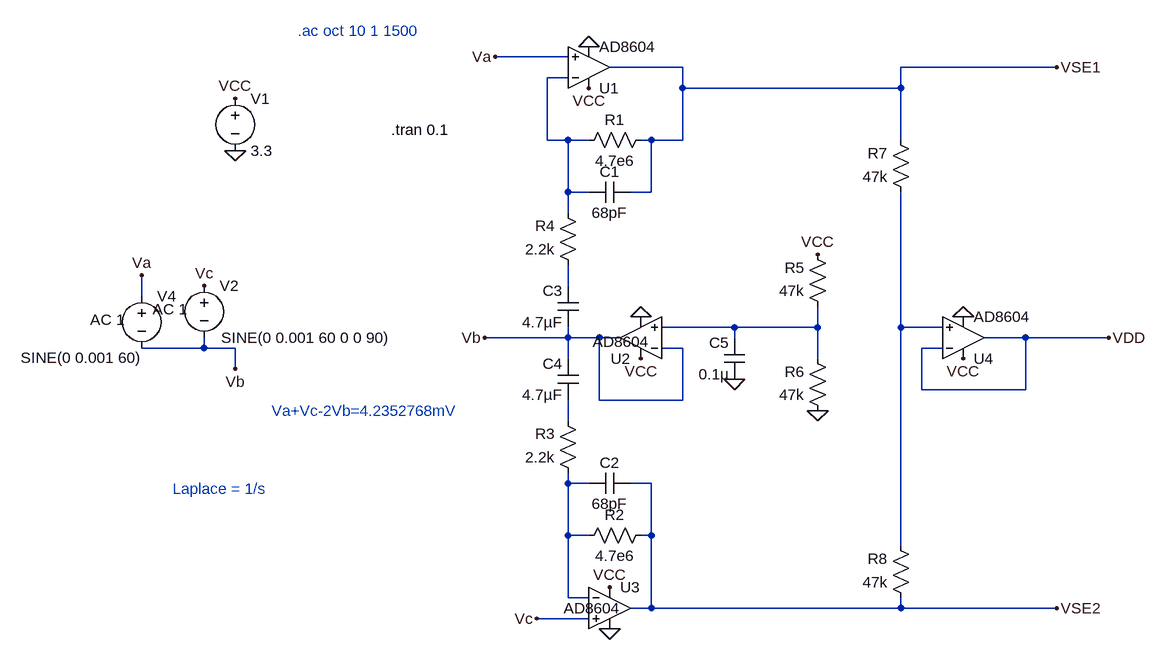
[diagram p0: schematic DDA_AD8604_transient.asc]
DDA_AD8604_transient.asc, the LTspice schematic file:
Version 4
SHEET 1 1816 824
WIRE 144 -320 32 -320
WIRE 320 -304 208 -304
WIRE 896 -304 656 -304
WIRE 144 -288 112 -288
WIRE 320 -272 320 -304
WIRE 656 -272 656 -304
WIRE 656 -272 320 -272
WIRE 112 -192 112 -288
WIRE 144 -192 112 -192
WIRE 176 -192 144 -192
WIRE 272 -192 256 -192
WIRE 320 -192 320 -272
WIRE 320 -192 272 -192
WIRE 656 -192 656 -272
WIRE 144 -112 144 -192
WIRE 176 -112 144 -112
WIRE 272 -112 272 -192
WIRE 272 -112 240 -112
WIRE 144 -80 144 -112
WIRE 144 32 144 0
WIRE -512 48 -512 16
WIRE 400 96 288 96
WIRE 528 96 528 64
WIRE 528 96 400 96
WIRE 656 96 656 -112
WIRE 720 96 656 96
WIRE 144 112 144 96
WIRE 144 112 16 112
WIRE 192 112 144 112
WIRE 224 112 192 112
WIRE 400 112 400 96
WIRE 848 112 784 112
WIRE 976 112 848 112
WIRE -416 128 -416 112
WIRE -416 128 -512 128
WIRE -368 128 -416 128
WIRE 320 128 288 128
WIRE 720 128 688 128
WIRE 144 144 144 112
WIRE 528 144 528 96
WIRE -368 160 -368 128
WIRE 688 192 688 128
WIRE 848 192 848 112
WIRE 848 192 688 192
WIRE 192 208 192 112
WIRE 320 208 320 128
WIRE 320 208 192 208
WIRE 144 240 144 208
WIRE 144 336 144 320
WIRE 176 336 144 336
WIRE 272 336 240 336
WIRE 144 416 144 336
WIRE 176 416 144 416
WIRE 272 416 272 336
WIRE 272 416 256 416
WIRE 656 432 656 96
WIRE 144 512 144 416
WIRE 176 512 144 512
WIRE 272 528 272 416
WIRE 272 528 240 528
WIRE 656 528 656 512
WIRE 656 528 272 528
WIRE 896 528 656 528
WIRE 176 544 96 544
FLAG -368 -176 0
FLAG 400 176 0
FLAG 528 224 0
FLAG -368 -256 VCC
FLAG 176 -272 VCC
FLAG 208 496 VCC
FLAG 208 560 0
FLAG 752 144 VCC
FLAG 256 80 0
FLAG 752 80 0
FLAG 176 -336 0
FLAG 528 -16 VCC
FLAG 32 -320 Va
FLAG 96 544 Vc
FLAG 976 112 VDD
FLAG 896 -304 VSE1
FLAG 896 528 VSE2
FLAG -512 16 Va
FLAG -416 32 Vc
FLAG 16 112 Vb
FLAG -368 160 Vb
FLAG 256 144 VCC
SYMBOL cap 240 -128 R90
WINDOW 0 0 32 VBottom 2
WINDOW 3 32 32 VTop 2
SYMATTR InstName C1
SYMATTR Value 68pF
SYMBOL cap 240 320 R90
WINDOW 0 0 32 VBottom 2
WINDOW 3 32 32 VTop 2
SYMATTR InstName C2
SYMATTR Value 68pF
SYMBOL cap 160 96 R180
WINDOW 0 24 56 Left 2
WINDOW 3 24 8 Left 2
SYMATTR InstName C3
SYMATTR Value 4.7µF
SYMBOL cap 160 208 R180
WINDOW 0 24 56 Left 2
WINDOW 3 24 8 Left 2
SYMATTR InstName C4
SYMATTR Value 4.7µF
SYMBOL cap 416 176 R180
WINDOW 0 24 56 Left 2
WINDOW 3 24 8 Left 2
SYMATTR InstName C5
SYMATTR Value 0.1µ
SYMBOL res 272 -208 R90
WINDOW 0 0 56 VBottom 2
WINDOW 3 32 56 VTop 2
SYMATTR InstName R1
SYMATTR Value 4.7e6
SYMBOL res 272 400 R90
WINDOW 0 0 56 VBottom 2
WINDOW 3 32 56 VTop 2
SYMATTR InstName R2
SYMATTR Value 4.7e6
SYMBOL res 160 336 R180
WINDOW 0 36 76 Left 2
WINDOW 3 36 40 Left 2
SYMATTR InstName R3
SYMATTR Value 2.2k
SYMBOL res 160 16 R180
WINDOW 0 36 76 Left 2
WINDOW 3 36 40 Left 2
SYMATTR InstName R4
SYMATTR Value 2.2k
SYMBOL res 544 80 R180
WINDOW 0 36 76 Left 2
WINDOW 3 36 40 Left 2
SYMATTR InstName R5
SYMATTR Value 47k
SYMBOL res 544 240 R180
WINDOW 0 36 76 Left 2
WINDOW 3 36 40 Left 2
SYMATTR InstName R6
SYMATTR Value 47k
SYMBOL res 672 -96 R180
WINDOW 0 36 76 Left 2
WINDOW 3 36 40 Left 2
SYMATTR InstName R7
SYMATTR Value 47k
SYMBOL res 672 528 R180
WINDOW 0 36 76 Left 2
WINDOW 3 36 40 Left 2
SYMATTR InstName R8
SYMATTR Value 47k
SYMBOL voltage -512 32 R0
WINDOW 123 -79 52 Left 2
WINDOW 39 0 0 Left 0
WINDOW 3 -186 111 Left 2
SYMATTR Value2 AC 1
SYMATTR Value SINE(0 0.001 60)
SYMATTR InstName V4
SYMBOL voltage -368 -272 R0
WINDOW 123 0 0 Left 0
WINDOW 39 0 0 Left 0
SYMATTR InstName V1
SYMATTR Value 3.3
SYMBOL OpAmps\\AD8604 176 -240 M180
SYMATTR InstName U1
SYMBOL OpAmps\\AD8604 256 176 R180
WINDOW 3 -13 58 Left 2
SYMATTR InstName U2
SYMBOL OpAmps\\AD8604 208 464 R0
WINDOW 3 -71 64 Left 2
SYMATTR InstName U3
SYMBOL OpAmps\\AD8604 752 176 M180
SYMATTR InstName U4
SYMBOL voltage -416 16 R0
WINDOW 123 -79 52 Left 2
WINDOW 39 0 0 Left 0
WINDOW 3 26 96 Left 2
SYMATTR Value2 AC 1
SYMATTR Value SINE(0 0.001 60 0 0 90)
SYMATTR InstName V2
TEXT -272 -360 Left 2 ;.ac oct 10 1 1500
TEXT -464 344 Left 2 ;Laplace = 1/s
TEXT -128 -208 Left 2 !.tran 0.1
TEXT -312 224 Left 2 ;Va+Vc-2Vb=4.2352768mV

The netlist it stands for:
* DDA_AD8604_transient.asc
C1 VSE1 N001 68pF
C2 VSE2 N006 68pF
C3 Vb N002 4.7µF
C4 N005 Vb 4.7µF
C5 0 N003 0.1µ
R1 VSE1 N001 4.7e6
R2 VSE2 N006 4.7e6
R3 N006 N005 2.2k
R4 N002 N001 2.2k
R5 N003 VCC 47k
R6 0 N003 47k
R7 N004 VSE1 47k
R8 VSE2 N004 47k
V4 Va Vb SINE(0 0.001 60) AC 1
V1 VCC 0 3.3
XU1 Va N001 VCC 0 VSE1 AD8604  ; pins In+ In- V+ V- OUT
XU2 N003 Vb VCC 0 Vb AD8604  ; pins In+ In- V+ V- OUT
XU3 Vc N006 VCC 0 VSE2 AD8604  ; pins In+ In- V+ V- OUT
XU4 N004 VDD VCC 0 VDD AD8604  ; pins In+ In- V+ V- OUT
V2 Vc Vb SINE(0 0.001 60 0 0 90) AC 1
* .ac oct 10 1 1500
* Laplace = 1/s
.tran 0.1
* Va+Vc-2Vb=4.2352768mV
.backanno
.end